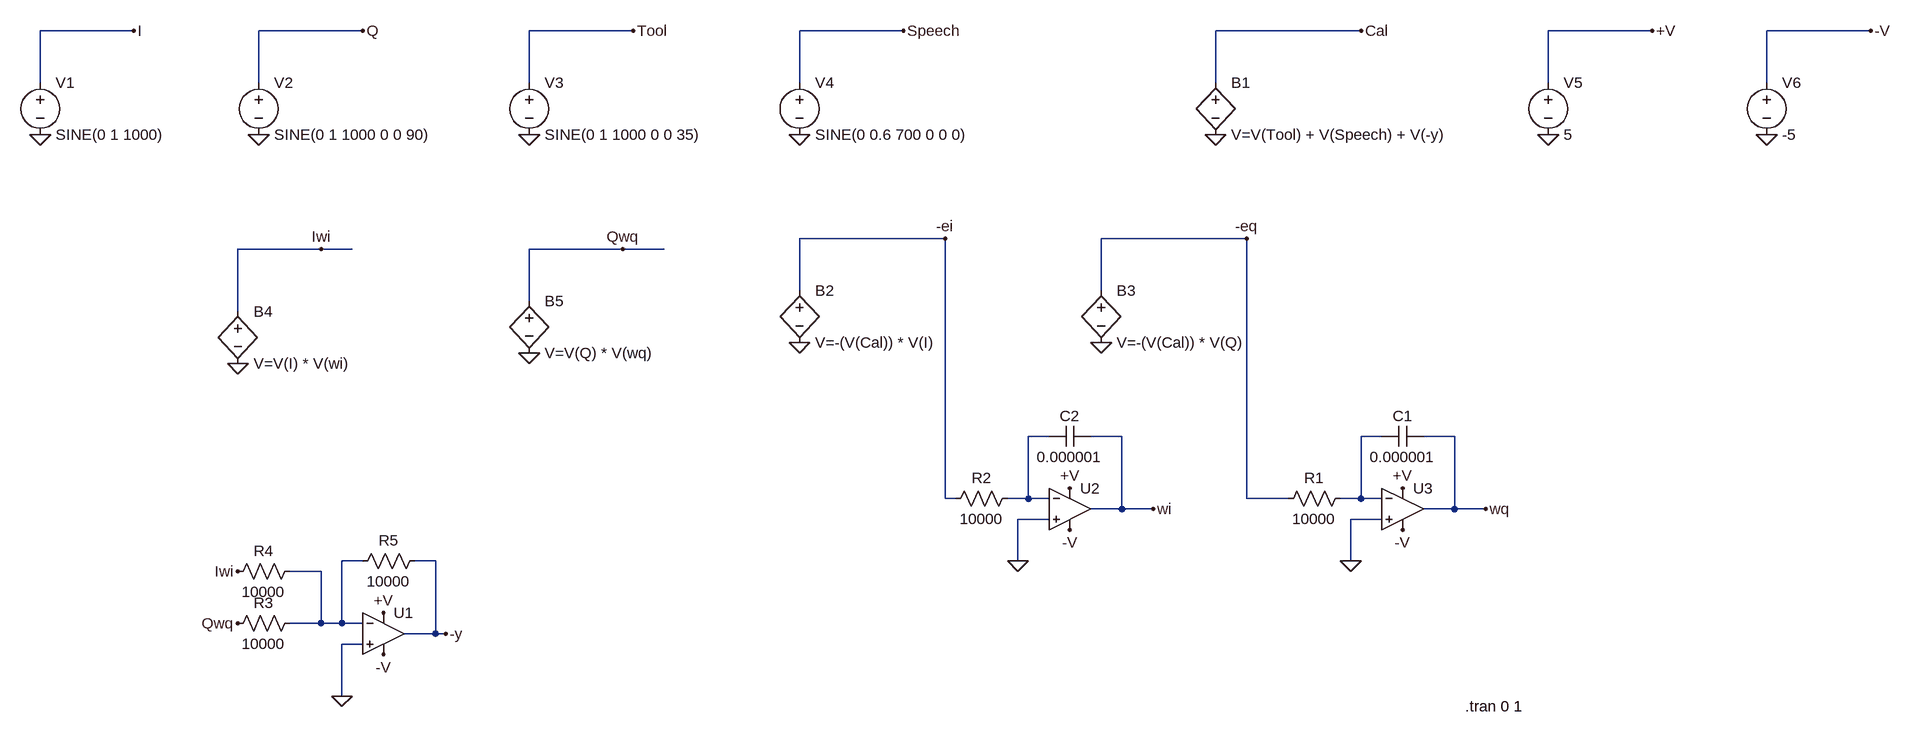
[diagram p0: schematic ancsim_old.asc]
ancsim_old.asc, the LTspice schematic file:
Version 4
SHEET 1 3036 1072
WIRE 320 16 176 16
WIRE 672 16 512 16
WIRE 1088 16 928 16
WIRE 1504 16 1344 16
WIRE 2208 16 1984 16
WIRE 2656 16 2496 16
WIRE 2992 16 2832 16
WIRE 176 96 176 16
WIRE 512 96 512 16
WIRE 928 96 928 16
WIRE 1344 96 1344 16
WIRE 1984 96 1984 16
WIRE 2496 96 2496 16
WIRE 2832 96 2832 16
WIRE 1568 336 1344 336
WIRE 2032 336 1808 336
WIRE 608 352 480 352
WIRE 656 352 608 352
WIRE 1072 352 928 352
WIRE 1136 352 1072 352
WIRE 1344 416 1344 336
WIRE 1808 416 1808 336
WIRE 928 432 928 352
WIRE 480 448 480 352
WIRE 1728 640 1696 640
WIRE 1840 640 1792 640
WIRE 2240 640 2208 640
WIRE 2352 640 2304 640
WIRE 1568 736 1568 336
WIRE 1584 736 1568 736
WIRE 1696 736 1696 640
WIRE 1696 736 1664 736
WIRE 1728 736 1696 736
WIRE 2032 736 2032 336
WIRE 2096 736 2032 736
WIRE 2208 736 2208 640
WIRE 2208 736 2176 736
WIRE 2240 736 2208 736
WIRE 1840 752 1840 640
WIRE 1840 752 1792 752
WIRE 1888 752 1840 752
WIRE 2352 752 2352 640
WIRE 2352 752 2304 752
WIRE 2400 752 2352 752
WIRE 1728 768 1680 768
WIRE 2240 768 2192 768
WIRE 672 832 640 832
WIRE 784 832 752 832
WIRE 1680 832 1680 768
WIRE 2192 832 2192 768
WIRE 608 848 560 848
WIRE 608 928 608 848
WIRE 608 928 560 928
WIRE 640 928 640 832
WIRE 640 928 608 928
WIRE 672 928 640 928
WIRE 784 944 784 832
WIRE 784 944 736 944
WIRE 800 944 784 944
WIRE 672 960 640 960
WIRE 640 1040 640 960
FLAG 176 176 0
FLAG 512 176 0
FLAG 928 176 0
FLAG 1344 176 0
FLAG 320 16 I
FLAG 672 16 Q
FLAG 1088 16 Tool
FLAG 1504 16 Speech
FLAG 1984 176 0
FLAG 2208 16 Cal
FLAG 1344 496 0
FLAG 1808 496 0
FLAG 1568 336 -ei
FLAG 2032 336 -eq
FLAG 2192 832 0
FLAG 2400 752 wq
FLAG 1680 832 0
FLAG 1888 752 wi
FLAG 2496 176 0
FLAG 2656 16 +V
FLAG 2832 176 0
FLAG 2992 16 -V
FLAG 704 912 +V
FLAG 1760 720 +V
FLAG 2272 720 +V
FLAG 2272 784 -V
FLAG 1760 784 -V
FLAG 704 976 -V
FLAG 480 528 0
FLAG 928 512 0
FLAG 608 352 Iwi
FLAG 1072 352 Qwq
FLAG 480 848 Iwi
FLAG 480 928 Qwq
FLAG 800 944 -y
FLAG 640 1040 0
SYMBOL voltage 176 80 R0
SYMATTR InstName V1
SYMATTR Value SINE(0 1 1000)
SYMBOL voltage 512 80 R0
SYMATTR InstName V2
SYMATTR Value SINE(0 1 1000 0 0 90)
SYMBOL voltage 928 80 R0
SYMATTR InstName V3
SYMATTR Value SINE(0 1 1000 0 0 35)
SYMBOL voltage 1344 80 R0
SYMATTR InstName V4
SYMATTR Value SINE(0 0.6 700 0 0 0)
SYMBOL bv 1984 80 R0
SYMATTR InstName B1
SYMATTR Value V=V(Tool) + V(Speech) + V(-y)
SYMBOL OpAmps/UniversalOpAmp2 704 944 R0
SYMATTR InstName U1
SYMATTR Value2 Avol=1Meg GBW=10Meg Slew=20Meg
SYMBOL OpAmps/UniversalOpAmp2 2272 752 R0
SYMATTR InstName U3
SYMBOL bv 1344 400 R0
SYMATTR InstName B2
SYMATTR Value V=-(V(Cal)) * V(I)
SYMBOL bv 1808 400 R0
SYMATTR InstName B3
SYMATTR Value V=-(V(Cal)) * V(Q)
SYMBOL Res 2192 720 R90
WINDOW 0 0 56 VBottom 2
WINDOW 3 32 56 VTop 2
SYMATTR InstName R1
SYMATTR Value 10000
SYMBOL Cap 2304 624 R90
WINDOW 0 0 32 VBottom 2
WINDOW 3 32 32 VTop 2
SYMATTR InstName C1
SYMATTR Value 0.000001
SYMBOL OpAmps/UniversalOpAmp2 1760 752 R0
SYMATTR InstName U2
SYMBOL Res 1680 720 R90
WINDOW 0 0 56 VBottom 2
WINDOW 3 32 56 VTop 2
SYMATTR InstName R2
SYMATTR Value 10000
SYMBOL Cap 1792 624 R90
WINDOW 0 0 32 VBottom 2
WINDOW 3 32 32 VTop 2
SYMATTR InstName C2
SYMATTR Value 0.000001
SYMBOL voltage 2496 80 R0
SYMATTR InstName V5
SYMATTR Value 5
SYMBOL voltage 2832 80 R0
SYMATTR InstName V6
SYMATTR Value -5
SYMBOL bv 480 432 R0
SYMATTR InstName B4
SYMATTR Value V=V(I) * V(wi)
SYMBOL bv 928 416 R0
SYMATTR InstName B5
SYMATTR Value V=V(Q) * V(wq)
SYMBOL Res 576 912 R90
WINDOW 0 0 56 VBottom 2
WINDOW 3 32 56 VTop 2
SYMATTR InstName R3
SYMATTR Value 10000
SYMBOL Res 576 832 R90
WINDOW 0 0 56 VBottom 2
WINDOW 3 32 56 VTop 2
SYMATTR InstName R4
SYMATTR Value 10000
SYMBOL Res 768 816 R90
WINDOW 0 0 56 VBottom 2
WINDOW 3 32 56 VTop 2
SYMATTR InstName R5
SYMATTR Value 10000
TEXT 2368 1056 Left 2 !.tran 0 1

The netlist it stands for:
* ancsim_old.asc
V1 I 0 SINE(0 1 1000)
V2 Q 0 SINE(0 1 1000 0 0 90)
V3 Tool 0 SINE(0 1 1000 0 0 35)
V4 Speech 0 SINE(0 0.6 700 0 0 0)
B1 Cal 0 V=V(Tool) + V(Speech) + V(-y)
XU1 0 N003 +V -V -y level2 Avol=1Meg GBW=10Meg Slew=20Meg Ilimit=25m Rail=0 Vos=0 En=0 Enk=0 In=0 Ink=0 Rin=500Meg  ; pins In+ In- V+ V- OUT
XU3 0 N002 +V -V wq level2 Avol=1Meg GBW=10Meg Slew=10Meg Ilimit=25m Rail=0 Vos=0 En=0 Enk=0 In=0 Ink=0 Rin=500Meg  ; pins In+ In- V+ V- OUT
B2 -ei 0 V=-(V(Cal)) * V(I)
B3 -eq 0 V=-(V(Cal)) * V(Q)
R1 N002 -eq 10000
C1 wq N002 0.000001
XU2 0 N001 +V -V wi level2 Avol=1Meg GBW=10Meg Slew=10Meg Ilimit=25m Rail=0 Vos=0 En=0 Enk=0 In=0 Ink=0 Rin=500Meg  ; pins In+ In- V+ V- OUT
R2 N001 -ei 10000
C2 wi N001 0.000001
V5 +V 0 5
V6 -V 0 -5
B4 Iwi 0 V=V(I) * V(wi)
B5 Qwq 0 V=V(Q) * V(wq)
R3 N003 Qwq 10000
R4 N003 Iwi 10000
R5 -y N003 10000
.tran 0 1
.lib UniversalOpAmp2.lib
.backanno
.end